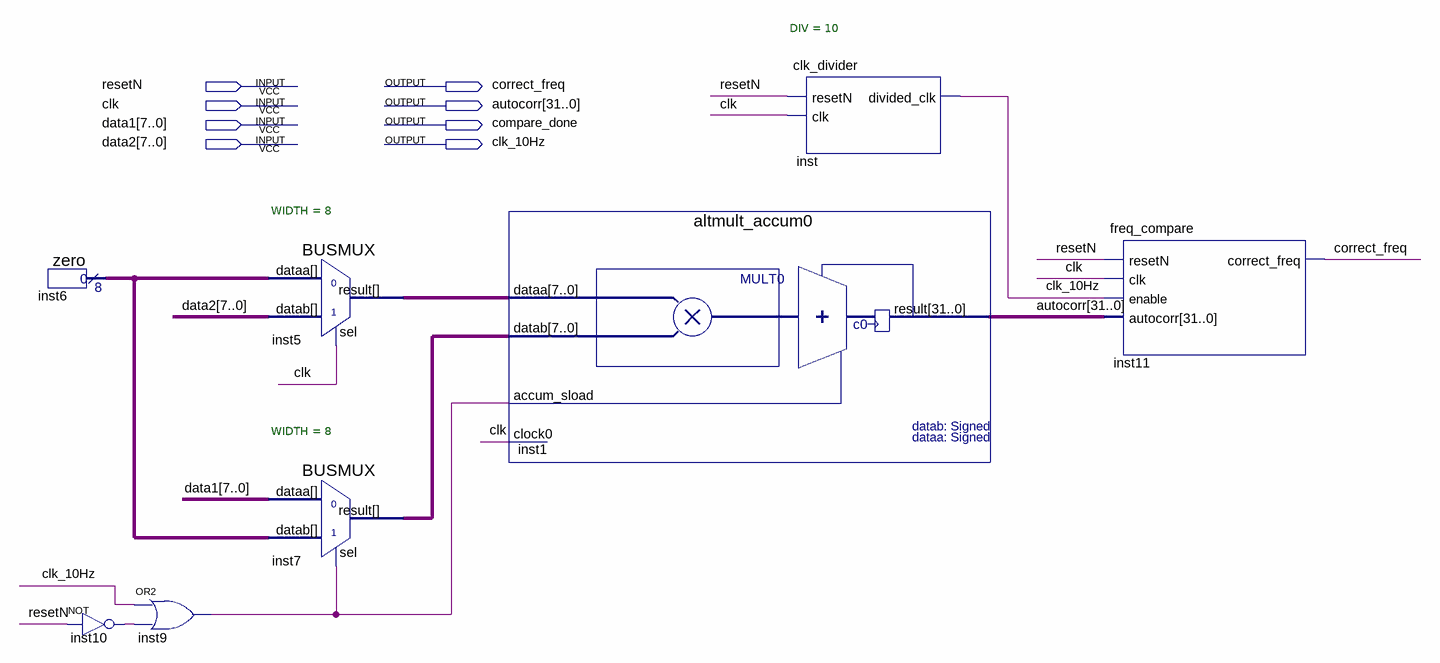
[diagram p0: schematic sheet]
// Quartus schematic acumm.bdf as structural Verilog: 8 symbols, 8 pins
module acumm (
  input  resetN,
  input  clk,
  input  [7:0] data1,
  input  [7:0] data2,
  output correct_freq,
  output [31:0] autocorr,
  output compare_done,
  output clk_10Hz
);

  wire inst9_out, inst10_out;
  wire [7:0] inst5_result, inst6_result, inst7_result;

  zero inst6 (.result(inst6_result));
  or inst9 (inst9_out, clk_10Hz, inst10_out);
  not inst10 (inst10_out, resetN);
  BUSMUX #(.WIDTH(8)) inst5 (.datab(data2), .sel(clk), .dataa(inst6_result), .result(inst5_result));
  BUSMUX #(.WIDTH(8)) inst7 (.datab(inst6_result), .sel(inst9_out), .dataa(data1), .result(inst7_result));
  altmult_accum0 inst1 (
    .dataa(inst5_result), .datab(inst7_result), .accum_sload(inst9_out), .clock0(clk), .result(autocorr));
  clk_divider #(.DIV(10)) inst (.resetN(resetN), .clk(clk), .divided_clk(clk_10Hz));
  freq_compare inst11 (.resetN(resetN), .clk(clk), .enable(clk_10Hz), .autocorr(autocorr), .correct_freq(correct_freq));
endmodule
